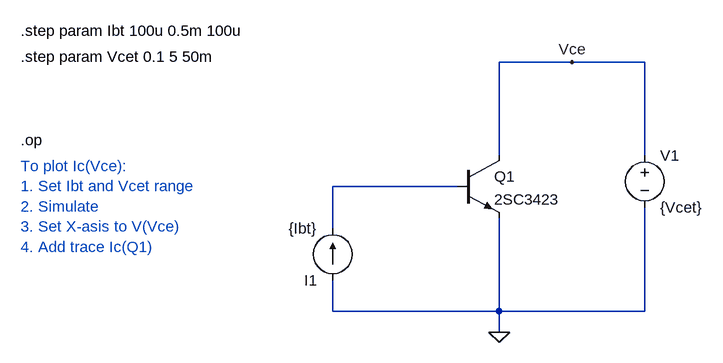
[diagram p0: schematic NPN - Ic(Vce).asc]
NPN - Ic(Vce).asc, the LTspice schematic file:
Version 4
SHEET 1 880 680
WIRE 176 0 64 0
WIRE 288 0 176 0
WIRE 64 144 64 0
WIRE 288 144 288 0
WIRE 0 192 -192 192
WIRE -192 256 -192 192
WIRE -192 384 -192 336
WIRE 64 384 64 240
WIRE 64 384 -192 384
WIRE 288 384 288 224
WIRE 288 384 64 384
WIRE 64 416 64 384
FLAG 64 416 0
FLAG 176 0 Vce
SYMBOL npn 0 144 R0
SYMATTR InstName Q1
SYMATTR Value 2SC3423
SYMBOL voltage 288 128 R0
WINDOW 123 0 0 Left 0
WINDOW 39 0 0 Left 0
SYMATTR InstName V1
SYMATTR Value {Vcet}
SYMBOL current -192 336 R180
WINDOW 123 0 0 Left 0
WINDOW 39 0 0 Left 0
SYMATTR InstName I1
SYMATTR Value {Ibt}
TEXT -672 -8 Left 0 !.step param Vcet 0.1 5 50m
TEXT -672 -48 Left 0 !.step param Ibt 100u 0.5m 100u
TEXT -672 120 Left 0 !.op
TEXT -672 160 Left 0 ;To plot Ic(Vce):\n1. Set Ibt and Vcet range\n2. Simulate\n3. Set X-asis to V(Vce)\n4. Add trace Ic(Q1)

The netlist it stands for:
* NPN - Ic(Vce).asc
Q1 Vce N001 0 0 2SC3423
V1 Vce 0 {Vcet}
I1 0 N001 {Ibt}
.model NPN NPN
.model PNP PNP
.lib standard.bjt
.step param Vcet 0.1 5 50m
.step param Ibt 100u 0.5m 100u
.op
* To plot Ic(Vce):
* 1. Set Ibt and Vcet range
* 2. Simulate
* 3. Set X-asis to V(Vce)
* 4. Add trace Ic(Q1)
.backanno
.end